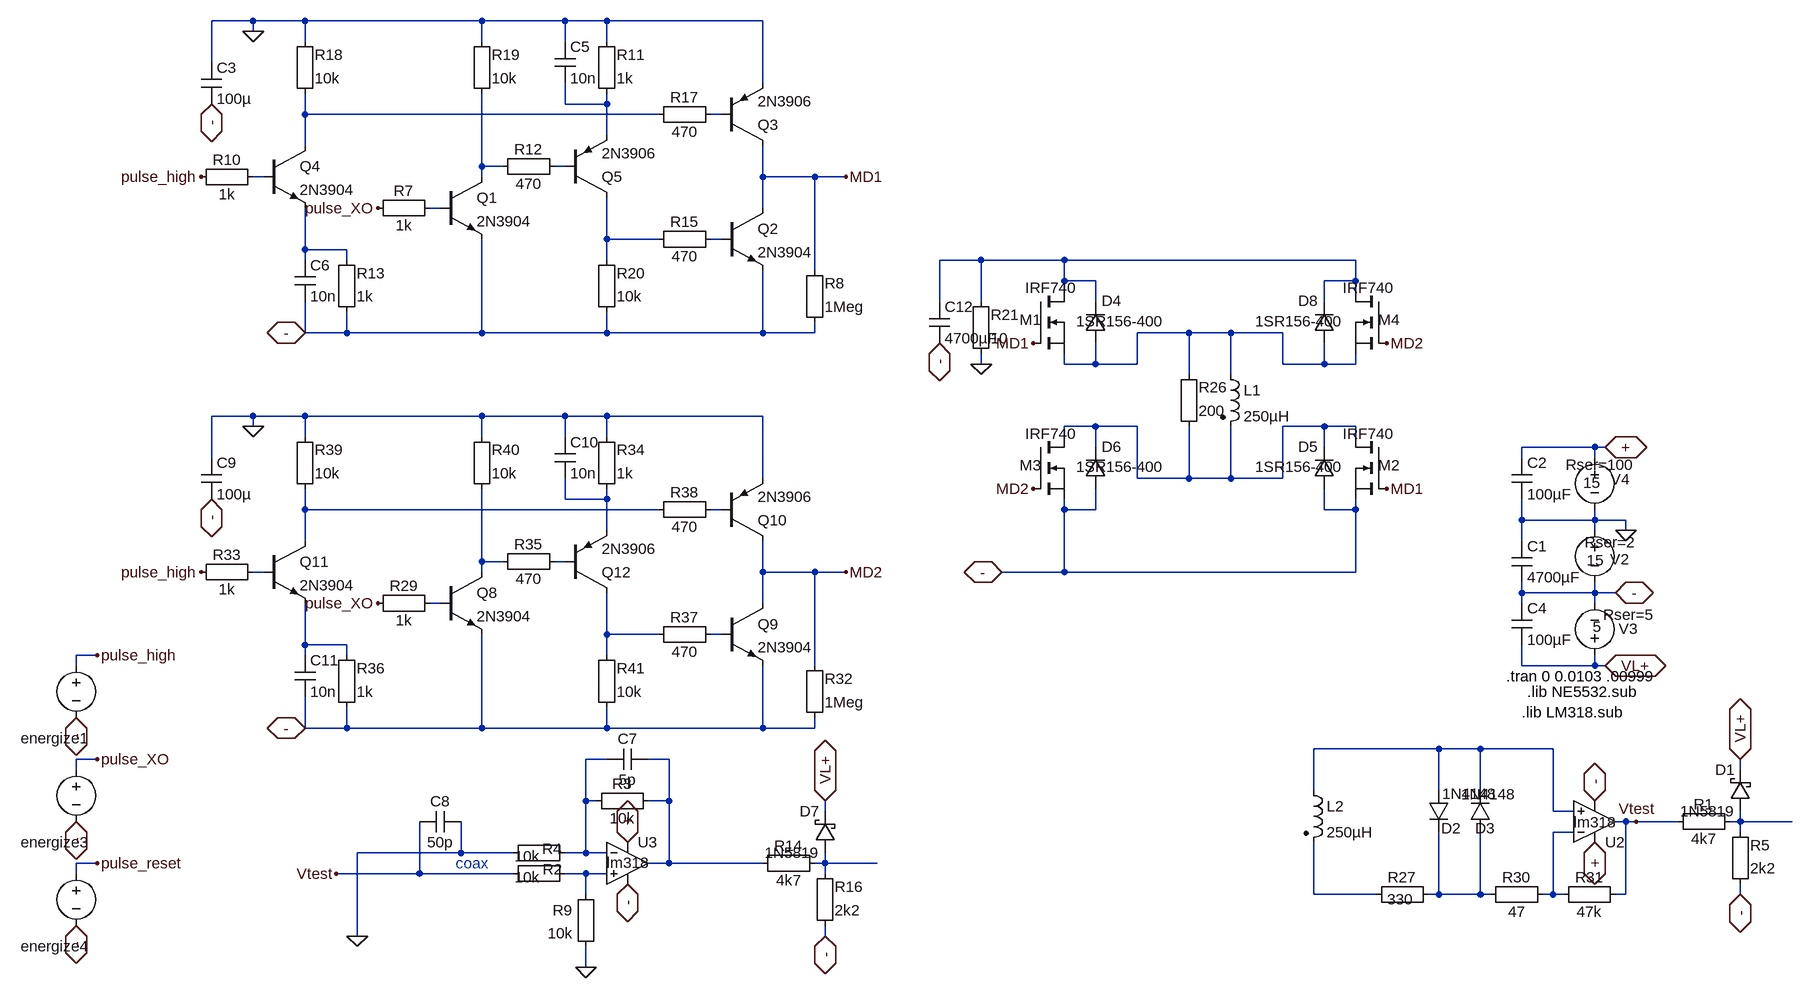
[diagram p0: schematic metal_low_power_fast_switch_ZVT_2.asc]
metal_low_power_fast_switch_ZVT_2.asc, the LTspice schematic file:
Version 4
SHEET 1 6068 1612
WIRE 96 -3040 32 -3040
WIRE 176 -3040 96 -3040
WIRE 448 -3040 176 -3040
WIRE 576 -3040 448 -3040
WIRE 640 -3040 576 -3040
WIRE 880 -3040 640 -3040
WIRE 96 -3024 96 -3040
WIRE 176 -3008 176 -3040
WIRE 448 -3008 448 -3040
WIRE 576 -3008 576 -3040
WIRE 640 -3008 640 -3040
WIRE 32 -2976 32 -3040
WIRE 880 -2944 880 -3040
WIRE 576 -2912 576 -2944
WIRE 640 -2912 640 -2928
WIRE 640 -2912 576 -2912
WIRE 176 -2896 176 -2928
WIRE 720 -2896 176 -2896
WIRE 816 -2896 800 -2896
WIRE 640 -2864 640 -2912
WIRE 176 -2848 176 -2896
WIRE 448 -2816 448 -2928
WIRE 480 -2816 448 -2816
WIRE 576 -2816 560 -2816
WIRE 112 -2800 96 -2800
WIRE 448 -2800 448 -2816
WIRE 880 -2800 880 -2848
WIRE 960 -2800 880 -2800
WIRE 1008 -2800 960 -2800
WIRE 384 -2752 368 -2752
WIRE 880 -2752 880 -2800
WIRE 640 -2704 640 -2768
WIRE 720 -2704 640 -2704
WIRE 816 -2704 800 -2704
WIRE 176 -2688 176 -2752
WIRE 240 -2688 176 -2688
WIRE 176 -2672 176 -2688
WIRE 240 -2672 240 -2688
WIRE 640 -2672 640 -2704
WIRE 1216 -2672 1152 -2672
WIRE 1344 -2672 1216 -2672
WIRE 1792 -2672 1344 -2672
WIRE 960 -2656 960 -2800
WIRE 1344 -2640 1344 -2672
WIRE 1392 -2640 1344 -2640
WIRE 1792 -2640 1792 -2672
WIRE 1792 -2640 1744 -2640
WIRE 1344 -2624 1344 -2640
WIRE 1792 -2624 1792 -2640
WIRE 1152 -2608 1152 -2672
WIRE 1216 -2608 1216 -2672
WIRE 1392 -2608 1392 -2640
WIRE 1744 -2608 1744 -2640
WIRE 176 -2560 176 -2608
WIRE 240 -2560 240 -2592
WIRE 240 -2560 176 -2560
WIRE 448 -2560 448 -2704
WIRE 448 -2560 240 -2560
WIRE 640 -2560 640 -2592
WIRE 640 -2560 448 -2560
WIRE 880 -2560 880 -2656
WIRE 880 -2560 640 -2560
WIRE 960 -2560 960 -2576
WIRE 960 -2560 880 -2560
WIRE 1536 -2560 1456 -2560
WIRE 1600 -2560 1536 -2560
WIRE 1680 -2560 1600 -2560
WIRE 1216 -2512 1216 -2528
WIRE 1344 -2512 1344 -2528
WIRE 1392 -2512 1392 -2544
WIRE 1392 -2512 1344 -2512
WIRE 1456 -2512 1456 -2560
WIRE 1456 -2512 1392 -2512
WIRE 1680 -2512 1680 -2560
WIRE 1744 -2512 1744 -2544
WIRE 1744 -2512 1680 -2512
WIRE 1792 -2512 1792 -2528
WIRE 1792 -2512 1744 -2512
WIRE 1536 -2496 1536 -2560
WIRE 1600 -2496 1600 -2560
WIRE 96 -2432 32 -2432
WIRE 176 -2432 96 -2432
WIRE 448 -2432 176 -2432
WIRE 576 -2432 448 -2432
WIRE 640 -2432 576 -2432
WIRE 880 -2432 640 -2432
WIRE 96 -2416 96 -2432
WIRE 1392 -2416 1344 -2416
WIRE 1456 -2416 1392 -2416
WIRE 1744 -2416 1680 -2416
WIRE 1792 -2416 1744 -2416
WIRE 176 -2400 176 -2432
WIRE 448 -2400 448 -2432
WIRE 576 -2400 576 -2432
WIRE 640 -2400 640 -2432
WIRE 1344 -2400 1344 -2416
WIRE 1792 -2400 1792 -2416
WIRE 1392 -2384 1392 -2416
WIRE 1744 -2384 1744 -2416
WIRE 2160 -2384 2048 -2384
WIRE 2176 -2384 2160 -2384
WIRE 32 -2368 32 -2432
WIRE 2048 -2368 2048 -2384
WIRE 2160 -2368 2160 -2384
WIRE 880 -2336 880 -2432
WIRE 1456 -2336 1456 -2416
WIRE 1536 -2336 1536 -2416
WIRE 1536 -2336 1456 -2336
WIRE 1600 -2336 1600 -2416
WIRE 1600 -2336 1536 -2336
WIRE 1680 -2336 1680 -2416
WIRE 1680 -2336 1600 -2336
WIRE 576 -2304 576 -2336
WIRE 640 -2304 640 -2320
WIRE 640 -2304 576 -2304
WIRE 176 -2288 176 -2320
WIRE 720 -2288 176 -2288
WIRE 816 -2288 800 -2288
WIRE 1344 -2288 1344 -2304
WIRE 1392 -2288 1392 -2320
WIRE 1392 -2288 1344 -2288
WIRE 1744 -2288 1744 -2320
WIRE 1792 -2288 1792 -2304
WIRE 1792 -2288 1744 -2288
WIRE 2048 -2272 2048 -2304
WIRE 2160 -2272 2160 -2288
WIRE 2160 -2272 2048 -2272
WIRE 2208 -2272 2160 -2272
WIRE 640 -2256 640 -2304
WIRE 2160 -2256 2160 -2272
WIRE 2208 -2256 2208 -2272
WIRE 176 -2240 176 -2288
WIRE 2048 -2240 2048 -2272
WIRE 448 -2208 448 -2320
WIRE 480 -2208 448 -2208
WIRE 576 -2208 560 -2208
WIRE 112 -2192 96 -2192
WIRE 448 -2192 448 -2208
WIRE 880 -2192 880 -2240
WIRE 960 -2192 880 -2192
WIRE 1008 -2192 960 -2192
WIRE 1344 -2192 1344 -2288
WIRE 1344 -2192 1248 -2192
WIRE 1792 -2192 1792 -2288
WIRE 1792 -2192 1344 -2192
WIRE 2048 -2160 2048 -2176
WIRE 2160 -2160 2160 -2176
WIRE 2160 -2160 2048 -2160
WIRE 2192 -2160 2160 -2160
WIRE 384 -2144 368 -2144
WIRE 880 -2144 880 -2192
WIRE 2048 -2144 2048 -2160
WIRE 2160 -2144 2160 -2160
WIRE 640 -2096 640 -2160
WIRE 720 -2096 640 -2096
WIRE 816 -2096 800 -2096
WIRE 176 -2080 176 -2144
WIRE 240 -2080 176 -2080
WIRE -144 -2064 -176 -2064
WIRE 176 -2064 176 -2080
WIRE 240 -2064 240 -2080
WIRE 640 -2064 640 -2096
WIRE -176 -2048 -176 -2064
WIRE 960 -2048 960 -2192
WIRE 2048 -2048 2048 -2080
WIRE 2160 -2048 2160 -2064
WIRE 2160 -2048 2048 -2048
WIRE 2176 -2048 2160 -2048
WIRE 176 -1952 176 -2000
WIRE 240 -1952 240 -1984
WIRE 240 -1952 176 -1952
WIRE 448 -1952 448 -2096
WIRE 448 -1952 240 -1952
WIRE 640 -1952 640 -1984
WIRE 640 -1952 448 -1952
WIRE 880 -1952 880 -2048
WIRE 880 -1952 640 -1952
WIRE 960 -1952 960 -1968
WIRE 960 -1952 880 -1952
WIRE 1920 -1920 1728 -1920
WIRE 1984 -1920 1920 -1920
WIRE 2096 -1920 1984 -1920
WIRE -144 -1904 -176 -1904
WIRE 640 -1904 608 -1904
WIRE 736 -1904 704 -1904
WIRE -176 -1888 -176 -1904
WIRE 2384 -1888 2384 -1904
WIRE 1728 -1856 1728 -1920
WIRE 1920 -1856 1920 -1920
WIRE 1984 -1856 1984 -1920
WIRE 608 -1840 608 -1904
WIRE 624 -1840 608 -1840
WIRE 736 -1840 736 -1904
WIRE 736 -1840 704 -1840
WIRE 976 -1824 976 -1840
WIRE 2096 -1824 2096 -1920
WIRE 2128 -1824 2096 -1824
WIRE 2208 -1808 2192 -1808
WIRE 2224 -1808 2208 -1808
WIRE 2288 -1808 2224 -1808
WIRE 2384 -1808 2384 -1824
WIRE 2384 -1808 2368 -1808
WIRE 2464 -1808 2384 -1808
WIRE 2128 -1792 2096 -1792
WIRE 2384 -1792 2384 -1808
WIRE 416 -1760 416 -1808
WIRE 416 -1760 256 -1760
WIRE 496 -1760 416 -1760
WIRE 608 -1760 608 -1840
WIRE 608 -1760 576 -1760
WIRE 640 -1760 608 -1760
WIRE -144 -1744 -176 -1744
WIRE 736 -1744 736 -1840
WIRE 736 -1744 704 -1744
WIRE 880 -1744 736 -1744
WIRE 976 -1744 976 -1760
WIRE 976 -1744 960 -1744
WIRE 1056 -1744 976 -1744
WIRE -176 -1728 -176 -1744
WIRE 352 -1728 352 -1808
WIRE 352 -1728 224 -1728
WIRE 496 -1728 352 -1728
WIRE 608 -1728 576 -1728
WIRE 640 -1728 608 -1728
WIRE 976 -1728 976 -1744
WIRE 608 -1696 608 -1728
WIRE 1728 -1696 1728 -1776
WIRE 1824 -1696 1728 -1696
WIRE 1920 -1696 1920 -1792
WIRE 1920 -1696 1904 -1696
WIRE 1984 -1696 1984 -1792
WIRE 1984 -1696 1920 -1696
WIRE 2000 -1696 1984 -1696
WIRE 2096 -1696 2096 -1792
WIRE 2096 -1696 2080 -1696
WIRE 2112 -1696 2096 -1696
WIRE 2208 -1696 2208 -1808
WIRE 2208 -1696 2192 -1696
WIRE 2384 -1696 2384 -1712
WIRE 256 -1632 256 -1760
WIRE 976 -1632 976 -1648
WIRE 608 -1584 608 -1616
FLAG 2192 -2160 -
IOPIN 2192 -2160 BiDir
FLAG 2176 -2384 +
IOPIN 2176 -2384 BiDir
FLAG 2208 -2256 0
FLAG 2176 -2048 VL+
IOPIN 2176 -2048 BiDir
FLAG 976 -1632 -
IOPIN 976 -1632 BiDir
FLAG 976 -1840 VL+
IOPIN 976 -1840 BiDir
FLAG 672 -1776 +
IOPIN 672 -1776 BiDir
FLAG 672 -1712 -
IOPIN 672 -1712 BiDir
FLAG 224 -1728 Vtest
FLAG 608 -1584 0
FLAG 256 -1632 0
FLAG 32 -2304 -
IOPIN 32 -2304 BiDir
FLAG 96 -2416 0
FLAG 2160 -1776 +
IOPIN 2160 -1776 BiDir
FLAG 2160 -1840 -
IOPIN 2160 -1840 BiDir
FLAG 2224 -1808 Vtest
FLAG 2384 -1696 -
IOPIN 2384 -1696 BiDir
FLAG 2384 -1904 VL+
IOPIN 2384 -1904 BiDir
FLAG -176 -1968 -
IOPIN -176 -1968 BiDir
FLAG -144 -2064 pulse_high
FLAG -176 -1808 -
IOPIN -176 -1808 BiDir
FLAG -144 -1904 pulse_XO
FLAG -176 -1648 -
IOPIN -176 -1648 BiDir
FLAG -144 -1744 pulse_reset
FLAG 288 -2144 pulse_XO
FLAG 16 -2192 pulse_high
FLAG 32 -2912 -
IOPIN 32 -2912 BiDir
FLAG 96 -3024 0
FLAG 288 -2752 pulse_XO
FLAG 16 -2800 pulse_high
FLAG 1008 -2800 MD1
FLAG 1008 -2192 MD2
FLAG 1296 -2320 MD2
FLAG 1840 -2544 MD2
FLAG 1296 -2544 MD1
FLAG 1840 -2320 MD1
FLAG 1152 -2544 -
IOPIN 1152 -2544 BiDir
FLAG 1216 -2512 0
FLAG 1248 -2192 -
IOPIN 1248 -2192 BiDir
FLAG 176 -2560 -
IOPIN 176 -2560 BiDir
FLAG 176 -1952 -
IOPIN 176 -1952 BiDir
SYMBOL voltage 2160 -2272 M0
WINDOW 123 0 0 Left 2
WINDOW 39 -63 34 Left 2
WINDOW 0 -53 60 Left 2
WINDOW 3 -15 62 Left 2
SYMATTR SpiceLine Rser=2
SYMATTR InstName V2
SYMATTR Value 15
SYMBOL voltage 2160 -2384 M0
WINDOW 123 0 0 Left 2
WINDOW 39 -61 27 Left 2
WINDOW 0 -54 49 Left 2
WINDOW 3 -9 55 Left 2
SYMATTR SpiceLine Rser=100
SYMATTR InstName V4
SYMATTR Value 15
SYMBOL voltage 2160 -2048 M180
WINDOW 123 0 0 Left 2
WINDOW 39 13 78 Left 2
WINDOW 0 37 57 Left 2
WINDOW 3 -3 60 Left 2
SYMATTR SpiceLine Rser=5
SYMATTR InstName V3
SYMATTR Value 5
SYMBOL Misc\\EuropeanCap 2032 -2240 R0
SYMATTR InstName C1
SYMATTR Value 4700µF
SYMATTR SpiceLine V=400 Irms=1 Rser=.32 Lser=0
SYMBOL Misc\\EuropeanCap 2032 -2368 R0
SYMATTR InstName C2
SYMATTR Value 100µF
SYMATTR SpiceLine V=400 Irms=1 Rser=.32 Lser=0
SYMBOL Misc\\EuropeanCap 2032 -2144 R0
SYMATTR InstName C4
SYMATTR Value 100µF
SYMATTR SpiceLine V=400 Irms=1 Rser=.32 Lser=0
SYMBOL Misc\\EuropeanResistor 864 -1728 R270
WINDOW 0 27 56 VTop 2
WINDOW 3 5 56 VBottom 2
SYMATTR InstName R14
SYMATTR Value 4k7
SYMBOL Misc\\EuropeanResistor 960 -1632 M180
WINDOW 0 31 76 Left 2
WINDOW 3 31 40 Left 2
SYMATTR InstName R16
SYMATTR Value 2k2
SYMBOL schottky 992 -1760 R180
WINDOW 0 24 64 Left 2
WINDOW 3 24 0 Left 2
SYMATTR InstName D7
SYMATTR Value 1N5819
SYMATTR Description Diode
SYMATTR Type diode
SYMBOL Opamps\\opamp2 672 -1808 R0
WINDOW 3 -32 63 Left 2
SYMATTR Value lm318
SYMATTR InstName U3
SYMBOL Misc\\EuropeanResistor 608 -1856 M90
WINDOW 0 5 56 VBottom 2
WINDOW 3 27 56 VTop 2
SYMATTR InstName R3
SYMATTR Value 10k
SYMBOL Misc\\EuropeanCap 704 -1888 M270
WINDOW 0 32 32 VTop 2
WINDOW 3 0 32 VBottom 2
SYMATTR InstName C7
SYMATTR Value 5p
SYMATTR SpiceLine V=400 Irms=1 Rser=.32 Lser=0
SYMBOL Misc\\EuropeanCap 416 -1792 M270
WINDOW 0 32 32 VTop 2
WINDOW 3 0 32 VBottom 2
SYMATTR InstName C8
SYMATTR Value 50p
SYMATTR SpiceLine V=400 Irms=1 Rser=.32 Lser=0
SYMBOL Misc\\EuropeanResistor 480 -1744 M90
WINDOW 0 25 77 VBottom 2
WINDOW 3 6 38 VTop 2
SYMATTR InstName R2
SYMATTR Value 10k
SYMBOL Misc\\EuropeanResistor 624 -1712 M0
SYMATTR InstName R9
SYMATTR Value 10k
SYMBOL Misc\\EuropeanResistor 480 -1776 M90
WINDOW 0 25 76 VBottom 2
WINDOW 3 6 38 VTop 2
SYMATTR InstName R4
SYMATTR Value 10k
SYMBOL Misc\\EuropeanCap 16 -2368 R0
SYMATTR InstName C9
SYMATTR Value 100µ
SYMATTR SpiceLine V=400 Irms=1 Rser=.32 Lser=0
SYMBOL Misc\\EuropeanResistor 1520 -2400 M180
WINDOW 0 31 76 Left 2
WINDOW 3 31 40 Left 2
SYMATTR InstName R26
SYMATTR Value 200
SYMBOL Misc\\EuropeanResistor 1808 -1712 M90
WINDOW 0 5 56 VBottom 2
WINDOW 3 8 53 VTop 2
SYMATTR InstName R27
SYMATTR Value 330
SYMBOL diode 1904 -1856 R0
WINDOW 3 21 5 Left 2
WINDOW 0 20 58 Left 2
SYMATTR Value 1N4148
SYMATTR InstName D2
SYMBOL diode 2000 -1792 R180
WINDOW 0 -7 6 Left 2
WINDOW 3 -39 58 Left 2
SYMATTR InstName D3
SYMATTR Value 1N4148
SYMBOL nmos 1296 -2400 R0
WINDOW 0 -21 44 Left 2
WINDOW 3 -12 -5 Left 2
SYMATTR InstName M3
SYMATTR Value IRF740
SYMBOL npn3 384 -2192 R0
SYMATTR InstName Q8
SYMATTR Value 2N3904
SYMBOL Misc\\EuropeanResistor 272 -2160 M90
WINDOW 0 5 56 VBottom 2
WINDOW 3 27 56 VTop 2
SYMATTR InstName R29
SYMATTR Value 1k
SYMBOL Opamps\\opamp2 2160 -1744 M180
WINDOW 3 -32 63 Left 2
SYMATTR Value lm318
SYMATTR InstName U2
SYMBOL Misc\\EuropeanResistor 1984 -1680 R270
WINDOW 0 27 56 VTop 2
WINDOW 3 5 56 VBottom 2
SYMATTR InstName R30
SYMATTR Value 47
SYMBOL Misc\\EuropeanResistor 2096 -1680 R270
WINDOW 0 27 56 VTop 2
WINDOW 3 5 56 VBottom 2
SYMATTR InstName R31
SYMATTR Value 47k
SYMBOL npn3 816 -2144 R0
SYMATTR InstName Q9
SYMATTR Value 2N3904
SYMBOL diode 1408 -2320 R180
WINDOW 0 -24 65 Left 2
WINDOW 3 -90 34 Left 2
SYMATTR InstName D6
SYMATTR Value 1SR156-400
SYMATTR Description Zener Diode
SYMATTR Type zener
SYMBOL pnp2 816 -2240 M180
SYMATTR InstName Q10
SYMATTR Value 2N3906
SYMBOL Misc\\EuropeanResistor 944 -1952 M180
WINDOW 0 31 76 Left 2
WINDOW 3 31 40 Left 2
SYMATTR InstName R32
SYMATTR Value 1Meg
SYMBOL voltage -176 -2064 M0
WINDOW 0 -21 128 Left 2
WINDOW 3 -134 119 Invisible 2
WINDOW 123 0 0 Left 2
SYMATTR InstName energize1
SYMATTR Value PULSE(0 4.8 .01 1e-8 1e-8 .002 .004 1000)
SYMATTR SpiceLine Rser=0
SYMBOL npn3 112 -2240 R0
SYMATTR InstName Q11
SYMATTR Value 2N3904
SYMBOL Misc\\EuropeanResistor 0 -2208 M90
WINDOW 0 5 56 VBottom 2
WINDOW 3 27 56 VTop 2
SYMATTR InstName R33
SYMATTR Value 1k
SYMBOL pnp2 576 -2160 M180
SYMATTR InstName Q12
SYMATTR Value 2N3906
SYMBOL Misc\\EuropeanResistor 624 -2304 M180
WINDOW 0 31 76 Left 2
WINDOW 3 31 40 Left 2
SYMATTR InstName R34
SYMATTR Value 1k
SYMBOL Misc\\EuropeanResistor 464 -2224 M90
WINDOW 0 5 56 VBottom 2
WINDOW 3 27 56 VTop 2
SYMATTR InstName R35
SYMATTR Value 470
SYMBOL Misc\\EuropeanCap 560 -2400 R0
SYMATTR InstName C10
SYMATTR Value 10n
SYMATTR SpiceLine V=400 Irms=1 Rser=.32 Lser=0
SYMBOL Misc\\EuropeanResistor 224 -1968 M180
WINDOW 0 31 76 Left 2
WINDOW 3 31 40 Left 2
SYMATTR InstName R36
SYMATTR Value 1k
SYMBOL Misc\\EuropeanCap 160 -2064 R0
SYMATTR InstName C11
SYMATTR Value 10n
SYMATTR SpiceLine V=400 Irms=1 Rser=.32 Lser=0
SYMBOL Misc\\EuropeanResistor 816 -2080 M270
WINDOW 0 27 56 VTop 2
WINDOW 3 5 56 VBottom 2
SYMATTR InstName R37
SYMATTR Value 470
SYMBOL Misc\\EuropeanResistor 704 -2304 M90
WINDOW 0 5 56 VBottom 2
WINDOW 3 27 56 VTop 2
SYMATTR InstName R38
SYMATTR Value 470
SYMBOL Misc\\EuropeanResistor 160 -2304 M180
WINDOW 0 31 76 Left 2
WINDOW 3 31 40 Left 2
SYMATTR InstName R39
SYMATTR Value 10k
SYMBOL Misc\\EuropeanResistor 432 -2304 M180
WINDOW 0 31 76 Left 2
WINDOW 3 31 40 Left 2
SYMATTR InstName R40
SYMATTR Value 10k
SYMBOL Misc\\EuropeanResistor 624 -1968 M180
WINDOW 0 31 76 Left 2
WINDOW 3 31 40 Left 2
SYMATTR InstName R41
SYMATTR Value 10k
SYMBOL ind2 1584 -2512 R0
SYMATTR InstName L1
SYMATTR Value 250µH
SYMATTR SpiceLine Rser=.4 Cpar=20p
SYMATTR Type ind
SYMBOL Misc\\EuropeanResistor 2272 -1792 R270
WINDOW 0 27 56 VTop 2
WINDOW 3 5 56 VBottom 2
SYMATTR InstName R1
SYMATTR Value 4k7
SYMBOL Misc\\EuropeanResistor 2368 -1696 M180
WINDOW 0 31 76 Left 2
WINDOW 3 31 40 Left 2
SYMATTR InstName R5
SYMATTR Value 2k2
SYMBOL schottky 2400 -1824 R180
WINDOW 0 24 64 Left 2
WINDOW 3 24 0 Left 2
SYMATTR InstName D1
SYMATTR Value 1N5819
SYMATTR Description Diode
SYMATTR Type diode
SYMBOL ind2 1712 -1872 R0
SYMATTR InstName L2
SYMATTR Value 250µH
SYMATTR SpiceLine Rser=.4 Cpar=20p
SYMATTR Type ind
SYMBOL nmos 1296 -2624 R0
WINDOW 0 -21 44 Left 2
WINDOW 3 -12 -5 Left 2
SYMATTR InstName M1
SYMATTR Value IRF740
SYMBOL diode 1408 -2544 R180
WINDOW 0 -24 65 Left 2
WINDOW 3 -90 34 Left 2
SYMATTR InstName D4
SYMATTR Value 1SR156-400
SYMATTR Description Zener Diode
SYMATTR Type zener
SYMBOL voltage -176 -1904 M0
WINDOW 0 -21 128 Left 2
WINDOW 3 -134 119 Invisible 2
WINDOW 123 0 0 Left 2
SYMATTR InstName energize3
SYMATTR Value PULSE(0 4.8 .0102 1e-8 1e-8 .002 .004 1000)
SYMATTR SpiceLine Rser=0
SYMBOL voltage -176 -1744 M0
WINDOW 0 -21 128 Left 2
WINDOW 3 -134 119 Invisible 2
WINDOW 123 0 0 Left 2
SYMATTR InstName energize4
SYMATTR Value PULSE(0 4.8 .0104 1e-8 1e-8 .002 .004 1000)
SYMATTR SpiceLine Rser=0
SYMBOL Misc\\EuropeanCap 16 -2976 R0
SYMATTR InstName C3
SYMATTR Value 100µ
SYMATTR SpiceLine V=400 Irms=1 Rser=.32 Lser=0
SYMBOL nmos 1840 -2400 M0
WINDOW 0 -21 44 Left 2
WINDOW 3 -12 -5 Left 2
SYMATTR InstName M2
SYMATTR Value IRF740
SYMBOL npn3 384 -2800 R0
SYMATTR InstName Q1
SYMATTR Value 2N3904
SYMBOL Misc\\EuropeanResistor 272 -2768 M90
WINDOW 0 5 56 VBottom 2
WINDOW 3 27 56 VTop 2
SYMATTR InstName R7
SYMATTR Value 1k
SYMBOL npn3 816 -2752 R0
SYMATTR InstName Q2
SYMATTR Value 2N3904
SYMBOL diode 1728 -2320 M180
WINDOW 0 -24 65 Left 2
WINDOW 3 -90 34 Left 2
SYMATTR InstName D5
SYMATTR Value 1SR156-400
SYMATTR Description Zener Diode
SYMATTR Type zener
SYMBOL pnp2 816 -2848 M180
SYMATTR InstName Q3
SYMATTR Value 2N3906
SYMBOL Misc\\EuropeanResistor 944 -2560 M180
WINDOW 0 31 76 Left 2
WINDOW 3 31 40 Left 2
SYMATTR InstName R8
SYMATTR Value 1Meg
SYMBOL npn3 112 -2848 R0
SYMATTR InstName Q4
SYMATTR Value 2N3904
SYMBOL Misc\\EuropeanResistor 0 -2816 M90
WINDOW 0 5 56 VBottom 2
WINDOW 3 27 56 VTop 2
SYMATTR InstName R10
SYMATTR Value 1k
SYMBOL pnp2 576 -2768 M180
SYMATTR InstName Q5
SYMATTR Value 2N3906
SYMBOL Misc\\EuropeanResistor 624 -2912 M180
WINDOW 0 31 76 Left 2
WINDOW 3 31 40 Left 2
SYMATTR InstName R11
SYMATTR Value 1k
SYMBOL Misc\\EuropeanResistor 464 -2832 M90
WINDOW 0 5 56 VBottom 2
WINDOW 3 27 56 VTop 2
SYMATTR InstName R12
SYMATTR Value 470
SYMBOL Misc\\EuropeanCap 560 -3008 R0
SYMATTR InstName C5
SYMATTR Value 10n
SYMATTR SpiceLine V=400 Irms=1 Rser=.32 Lser=0
SYMBOL Misc\\EuropeanResistor 224 -2576 M180
WINDOW 0 31 76 Left 2
WINDOW 3 31 40 Left 2
SYMATTR InstName R13
SYMATTR Value 1k
SYMBOL Misc\\EuropeanCap 160 -2672 R0
SYMATTR InstName C6
SYMATTR Value 10n
SYMATTR SpiceLine V=400 Irms=1 Rser=.32 Lser=0
SYMBOL Misc\\EuropeanResistor 816 -2688 M270
WINDOW 0 27 56 VTop 2
WINDOW 3 5 56 VBottom 2
SYMATTR InstName R15
SYMATTR Value 470
SYMBOL Misc\\EuropeanResistor 704 -2912 M90
WINDOW 0 5 56 VBottom 2
WINDOW 3 27 56 VTop 2
SYMATTR InstName R17
SYMATTR Value 470
SYMBOL Misc\\EuropeanResistor 160 -2912 M180
WINDOW 0 31 76 Left 2
WINDOW 3 31 40 Left 2
SYMATTR InstName R18
SYMATTR Value 10k
SYMBOL Misc\\EuropeanResistor 432 -2912 M180
WINDOW 0 31 76 Left 2
WINDOW 3 31 40 Left 2
SYMATTR InstName R19
SYMATTR Value 10k
SYMBOL Misc\\EuropeanResistor 624 -2576 M180
WINDOW 0 31 76 Left 2
WINDOW 3 31 40 Left 2
SYMATTR InstName R20
SYMATTR Value 10k
SYMBOL nmos 1840 -2624 M0
WINDOW 0 -21 44 Left 2
WINDOW 3 -12 -5 Left 2
SYMATTR InstName M4
SYMATTR Value IRF740
SYMBOL diode 1728 -2544 M180
WINDOW 0 -24 65 Left 2
WINDOW 3 -90 34 Left 2
SYMATTR InstName D8
SYMATTR Value 1SR156-400
SYMATTR Description Zener Diode
SYMATTR Type zener
SYMBOL Misc\\EuropeanCap 1136 -2608 R0
SYMATTR InstName C12
SYMATTR Value 4700µF
SYMATTR SpiceLine V=400 Irms=1 Rser=.32 Lser=0
SYMBOL Misc\\EuropeanResistor 1200 -2512 M180
WINDOW 0 31 76 Left 2
WINDOW 3 31 40 Left 2
SYMATTR InstName R21
SYMATTR Value 10
TEXT 2024 -2032 Left 2 !.tran 0 0.0103 .00999
TEXT 2056 -2008 Left 2 !.lib NE5532.sub
TEXT 2048 -1976 Left 2 !.lib LM318.sub
TEXT 408 -1744 Left 2 ;coax

The netlist it stands for:
* metal_low_power_fast_switch_ZVT_2.asc
V2 0 - 15 Rser=2
V4 + 0 15 Rser=100
V3 VL+ - 5 Rser=5
C1 0 - 4700µF V=400 Irms=1 Rser=.32 Lser=0
C2 + 0 100µF V=400 Irms=1 Rser=.32 Lser=0
C4 - VL+ 100µF V=400 Irms=1 Rser=.32 Lser=0
R14 N026 N029 4k7
R16 - N029 2k2
D7 N029 VL+ 1N5819
XU3 N030 N025 + - N026 lm318  ; pins In+ In- V+ V- OUT
R3 N025 N026 10k
C7 N026 N025 5p V=400 Irms=1 Rser=.32 Lser=0
C8 0 Vtest 50p V=400 Irms=1 Rser=.32 Lser=0
R2 Vtest N030 10k
R9 N030 0 10k
R4 0 N025 10k
C9 0 - 100µ V=400 Irms=1 Rser=.32 Lser=0
R26 N013 N012 200
R27 N031 N032 330
D2 N024 N032 1N4148
D3 N032 N024 1N4148
M3 N013 MD2 - - IRF740
Q8 N017 N020 - 0 2N3904
R29 pulse_XO N020 1k
XU2 N024 N028 + - Vtest lm318  ; pins In+ In- V+ V- OUT
R30 N032 N028 47
R31 N028 Vtest 47k
Q9 MD2 N022 - 0 2N3904
D6 - N013 1SR156-400
Q10 MD2 N016 0 0 2N3906
R32 - MD2 1Meg
V§energize1 pulse_high - PULSE(0 4.8 .01 1e-8 1e-8 .002 .004 1000) Rser=0
Q11 N015 N019 N023 0 2N3904
R33 pulse_high N019 1k
Q12 N021 N018 N014 0 2N3906
R34 N014 0 1k
R35 N017 N018 470
C10 0 N014 10n V=400 Irms=1 Rser=.32 Lser=0
R36 - N023 1k
C11 N023 - 10n V=400 Irms=1 Rser=.32 Lser=0
R37 N022 N021 470
R38 N015 N016 470
R39 N015 0 10k
R40 N017 0 10k
R41 - N021 10k
L1 N012 N013 250µH Rser=.4 Cpar=20p
R1 Vtest N027 4k7
R5 - N027 2k2
D1 N027 VL+ 1N5819
L2 N024 N031 250µH Rser=.4 Cpar=20p
M1 N011 MD1 N012 N012 IRF740
D4 N012 N011 1SR156-400
V§energize3 pulse_XO - PULSE(0 4.8 .0102 1e-8 1e-8 .002 .004 1000) Rser=0
V§energize4 pulse_reset - PULSE(0 4.8 .0104 1e-8 1e-8 .002 .004 1000) Rser=0
C3 0 - 100µ V=400 Irms=1 Rser=.32 Lser=0
M2 N013 MD1 - - IRF740
Q1 N004 N007 - 0 2N3904
R7 pulse_XO N007 1k
Q2 MD1 N009 - 0 2N3904
D5 - N013 1SR156-400
Q3 MD1 N003 0 0 2N3906
R8 - MD1 1Meg
Q4 N002 N006 N010 0 2N3904
R10 pulse_high N006 1k
Q5 N008 N005 N001 0 2N3906
R11 N001 0 1k
R12 N004 N005 470
C5 0 N001 10n V=400 Irms=1 Rser=.32 Lser=0
R13 - N010 1k
C6 N010 - 10n V=400 Irms=1 Rser=.32 Lser=0
R15 N009 N008 470
R17 N002 N003 470
R18 N002 0 10k
R19 N004 0 10k
R20 - N008 10k
M4 N011 MD2 N012 N012 IRF740
D8 N012 N011 1SR156-400
C12 N011 - 4700µF V=400 Irms=1 Rser=.32 Lser=0
R21 0 N011 10
.model D D
.lib standard.dio
.model NPN NPN
.model PNP PNP
.lib standard.bjt
.model NMOS NMOS
.model PMOS PMOS
.lib standard.mos
.tran 0 0.0103 .00999
.lib NE5532.sub
.lib LM318.sub
* coax
.backanno
.end